# Altium schematic sheet StartupMCU.SchDoc
size 431 x 279 mm; Organization: ORGANIZATION; Address1: ADDRESS 1; Address2: ADDRESS 2; Address3: ADDRESS 3; Address4: ADDRESS 4; Revision: -; SheetNumber: 5; SheetTotal: 5; ENG_APP_DATE: --/--/--; DSN_APP_DATE: --/--/--; CHK_APP_DATE: --/--/--
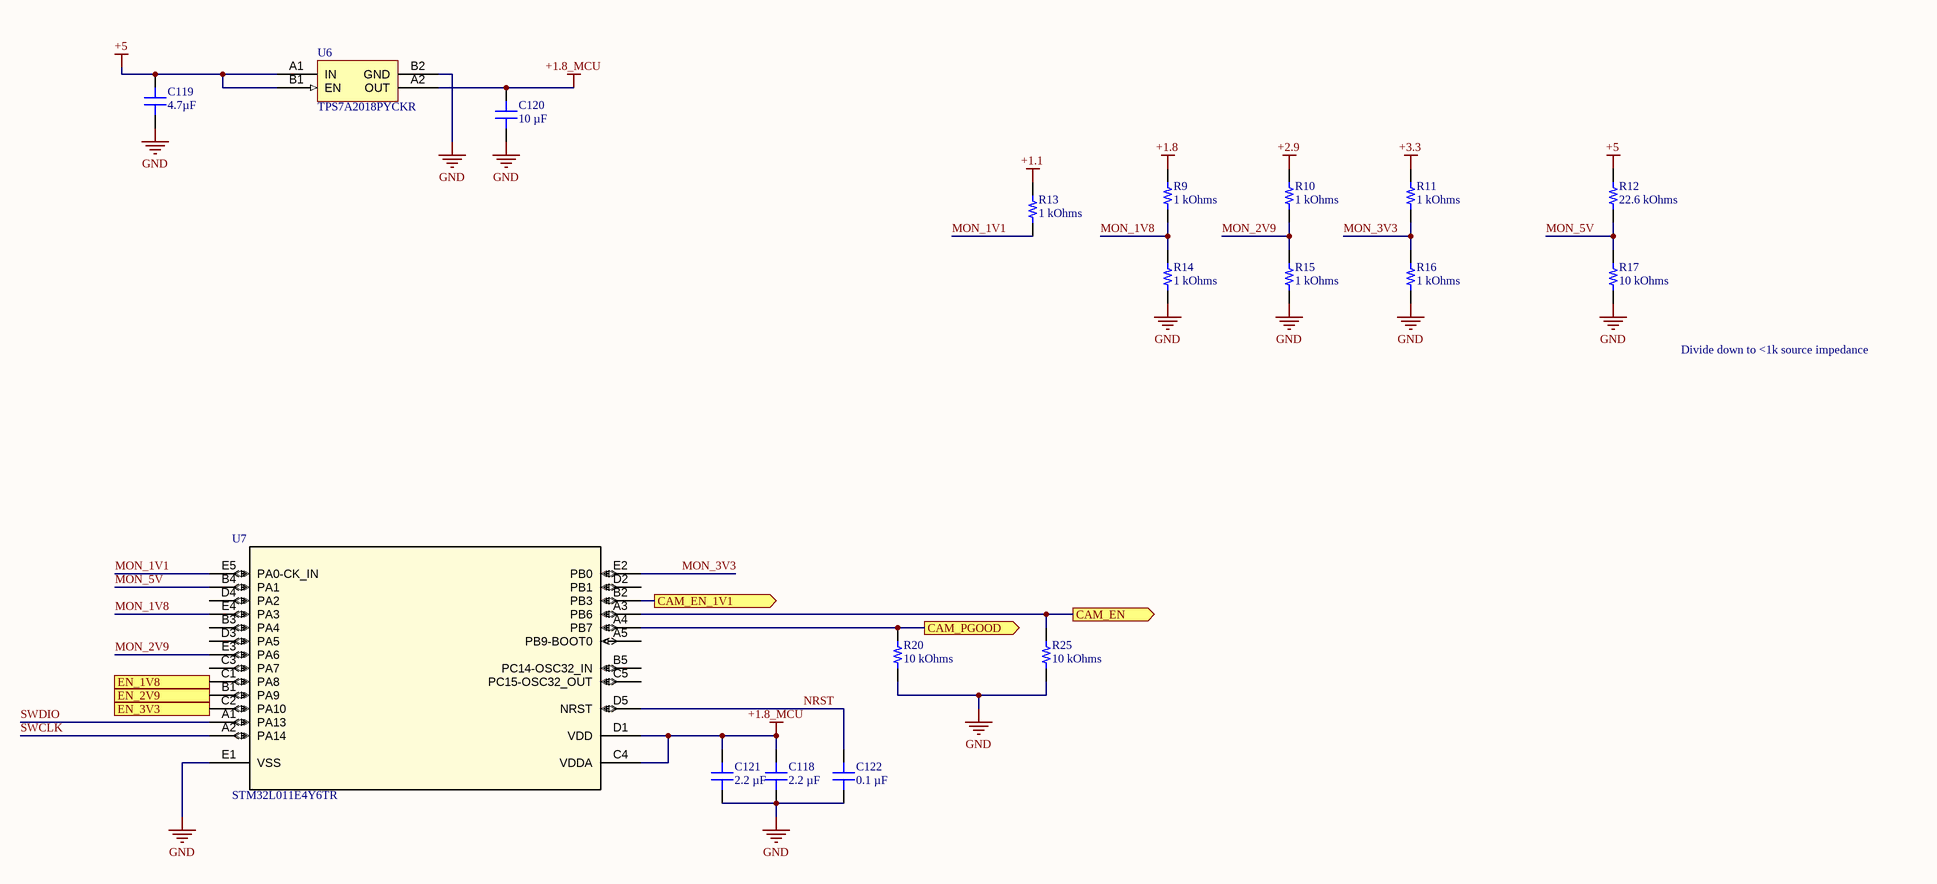
[diagram p0: StartupMCU.SchDoc]

## Parts
C118  2.2 µF  [FP-GRM033-0_09-MFG]
C119  4.7µF  [FP-GRM155-0_15-MFG]
C120  10 µF  [FP-GRM155-0_15-MFG]
C121  2.2 µF  [FP-GRM033-0_09-MFG]
C122  0.1 µF  [FP-GRM033-0_09-MFG]
R9  1 kOhms  [RES 0201_0603]
R10  1 kOhms  [RES 0201_0603]
R11  1 kOhms  [RES 0201_0603]
R12  22.6 kOhms  [RES 0201_0603]
R13  1 kOhms  [RES 0201_0603]
R14  1 kOhms  [RES 0201_0603]
R15  1 kOhms  [RES 0201_0603]
R16  1 kOhms  [RES 0201_0603]
R17  10 kOhms  [RES 0201_0603]
R20  10 kOhms  [RES 0201_0603]
R25  10 kOhms  [RES 0201_0603]
U6  TPS7A2018PYCKR  [BGA4C35P2X2_62X62X35]
U7  STM32L011E4Y6TR  [BGA25C40P5X5_207X213X58]

## Ports
CAM_EN (out), CAM_EN_1V1 (out), CAM_PGOOD (out), EN_1V8 (out), EN_2V9 (out), EN_3V3 (out)

## Nets
+1.1: R13.2
+1.8: R9.2
+1.8_MCU: C118.2 C120.2 C121.2 U6.A2(OUT) U7.C4(VDDA) U7.D1(VDD)
+2.9: R10.2
+3.3: R11.2
+5: C119.2 R12.2 U6.A1(IN) U6.B1(EN)
GND: C118.1 C119.1 C120.1 C121.1 C122.1 R14.1 R15.1 R16.1 R17.1 R20.1 R25.1 U6.B2(GND) U7.E1(VSS)
CAM_EN: R25.2 U7.A3(PB6) ; port CAM_EN
CAM_EN_1V1: U7.B2(PB3) ; port CAM_EN_1V1
CAM_PGOOD: R20.2 U7.A4(PB7) ; port CAM_PGOOD
EN_1V8: U7.C1(PA8) ; port EN_1V8
EN_2V9: U7.B1(PA9) ; port EN_2V9
EN_3V3: U7.C2(PA10) ; port EN_3V3
MON_1V1: R13.1 U7.E5(PA0-CK_IN)
MON_1V8: R9.1 R14.2 U7.E4(PA3)
MON_2V9: R10.1 R15.2 U7.E3(PA6)
MON_3V3: R11.1 R16.2 U7.E2(PB0)
MON_5V: R12.1 R17.2 U7.B4(PA1)
NRST: C122.2 U7.D5(NRST)
SWCLK: U7.A2(PA14)
SWDIO: U7.A1(PA13)

Not connected (* = marked no-connect by the designer): U7 A5(PB9-BOOT0) B3(PA4) B5(PC14-OSC32_IN) C3(PA7) C5(PC15-OSC32_OUT) D2(PB1) D3(PA5) D4(PA2)

## Notes on the sheet
- Divide down to <1k source impedance
- DWG. NO.
- REV.
- SHT.
- REVISION
- DESCRIPTION
- DATE
- APPROVED
- ENG:
- APPROVALS
- PROJECT
- DSN:
- CHK:
- REFERENCE DOCUMENTS
- PROJECT REVISION:
- TITLE
- SimulaVR
- DOCUMENT REVISION:
- DESIGN ITEM:
- BOM:
- FAB DWG:
- PCB DWG:
- ASSY DWG:
- SCALE:
- SIZE
- B
- CAGE CODE
- FILE NAME
- DWG NO.
- SHEET
- OF
- REV

## Library data of the parts
C118 C121 = GRM033R60J225ME01D: CAP CER 2.2UF 6.3V X5R 0201; manufacturer: Murata Electronics; Tolerance: ±20%; Part Number: GRM033R60J225ME01D; Value: 2.2 µF; Applications: General Purpose; Capacitance: 2.2 µF; componentlink1description: Datasheet; componentlink1url: https://search.murata.co.jp/Ceramy/image/img/A01X/G101/ENG/GRM033R60J225ME01-01A.pdf; componentlink2description: DigiKey Link; componentlink2url: https://www.digikey.com/en/products/detail/murata-electronics/GRM033R60J225ME01D/16033628; Device Package: 0201 (0603 Metric); lastupdated: 19.09.2022 12:54:17; Lifecycle Status: Active; Minimum Order: 1; Mounting Type: Surface Mount, MLCC; Operating Temperature: -55°C ~ 85°C; Package / Case: 0201 (0603 Metric); packaging: TapeAndReel; partid: 41005; Part Status: Active; price: 0.02; series: GRM; Size / Dimension: 0.024" L x 0.012" W (0.60mm x 0.30mm); Supplier 1: DigiKey; Supplier Part Number 1: 490-GRM033R60J225ME01DCT-ND; Temperature Coefficient: X5R; Thickness (Max): 0.015" (0.39mm); Voltage - Rated: 6.3V
C119 = GRM155R61A475MEAAD: CAP CER 4.7UF 10V X5R 0402; Manufacturer: Murata Electronics; Tolerance: ±20%; Part Number: GRM155R61A475MEAAD; Value: 4.7µF; Applications: General Purpose; Capacitance: 4.7µF; ComponentLink1Description: Datasheet; ComponentLink1URL: https://search.murata.co.jp/Ceramy/image/img/A01X/G101/ENG/GRM155R61A475MEAA-01.pdf; ComponentLink2Description: DigiKey Link; ComponentLink2URL: https://www.digikey.com/en/products/detail/murata-electronics/GRM155R61A475MEAAD/6234735; Device Package: 0402 (1005 Metric); LastUpdated: 2/8/2022 12:26:50 PM; Lifecycle Status: Active; Minimum Order: 1; Mounting Type: Surface Mount, MLCC; Operating Temperature: -55°C ~ 85°C; Package / Case: 0402 (1005 Metric); Packaging: TapeAndReel; PartId: 6746; Part Status: Active; Price: 0.03; Series: GRM; Size / Dimension: 0.039" L x 0.020" W (1.00mm x 0.50mm); Supplier 1: DigiKey; Supplier Part Number 1: 490-14306-1-ND; Temperature Coefficient: X5R; Thickness (Max): 0.026" (0.65mm); Voltage - Rated: 10V
C120 = GRM155R60J106ME15D: CAP CER 10UF 6.3V X5R 0402; manufacturer: Murata Electronics; Tolerance: ±20%; Part Number: GRM155R60J106ME15D; Value: 10 µF; Applications: General Purpose; Capacitance: 10 µF; componentlink1description: Datasheet; componentlink1url: https://www.murata.com/~/media/webrenewal/support/library/catalog/products/capacitor/mlcc/c02e.ashx?la=en-us; componentlink2description: DigiKey Link; componentlink2url: https://www.digikey.com/en/products/detail/murata-electronics/GRM155R60J106ME15D/5877401; Device Package: 0402 (1005 Metric); lastupdated: 19.09.2022 12:57:20; Lifecycle Status: Active; Minimum Order: 1; Mounting Type: Surface Mount, MLCC; Operating Temperature: -55°C ~ 85°C; Package / Case: 0402 (1005 Metric); packaging: TapeAndReel; partid: 6754; Part Status: Active; price: 0.02; series: GRM; Size / Dimension: 0.039" L x 0.020" W (1.00mm x 0.50mm); Supplier 1: DigiKey; Supplier Part Number 1: 490-13238-1-ND; Temperature Coefficient: X5R; Thickness (Max): 0.026" (0.65mm); Voltage - Rated: 6.3V
C122 = GRM033R61C104KE14D: CAP CER 0.1UF 16V X5R 0201; manufacturer: Murata Electronics; Tolerance: ±10%; Part Number: GRM033R61C104KE14D; Value: 0.1 µF; Applications: General Purpose; Capacitance: 0.1 µF; componentlink1description: Datasheet; componentlink1url: https://search.murata.co.jp/Ceramy/image/img/A01X/G101/ENG/GRM033R61C104KE14-01.pdf; componentlink2description: DigiKey Link; componentlink2url: https://www.digikey.com/en/products/detail/murata-electronics/GRM033R61C104KE14D/6234734; Device Package: 0201 (0603 Metric); lastupdated: 19.09.2022 12:54:28; Lifecycle Status: Active; Minimum Order: 1; Mounting Type: Surface Mount, MLCC; Operating Temperature: -55°C ~ 85°C; Package / Case: 0201 (0603 Metric); packaging: TapeAndReel; partid: 41462; Part Status: Active; price: 0.01; series: GRM; Size / Dimension: 0.024" L x 0.012" W (0.60mm x 0.30mm); Supplier 1: DigiKey; Supplier Part Number 1: 490-14305-1-ND; Temperature Coefficient: X5R; Thickness (Max): 0.013" (0.33mm); Voltage - Rated: 16V
R9-R11 R13-R16 = CRCW02011K00FKED: RES SMD 1K OHM 1% 1/20W 0201; Manufacturer: Vishay Dale; Power (Watts): 0.05W, 1/20W; Temperature Coefficient: ±100ppm/°C; Part Number: CRCW02011K00FKED; Value: 1 kOhms; ComponentLink1Description: Datasheet; ComponentLink1URL: http://www.vishay.com/docs/20052/crcw0201e3.pdf; ComponentLink2Description: DigiKey Link; ComponentLink2URL: https://www.digikey.com/en/products/detail/vishay-dale/CRCW02011K00FKED/1967979; Composition: Thick Film; Device Package: 0201 (0603 Metric); Height - Seated (Max): 0.010" (0.26mm); LastUpdated: 19.09.2022 13:09:18; Lifecycle Status: Active; Minimum Order: 1; Number of Terminations: 2; Operating Temperature: -55°C ~ 155°C; Package / Case: 0201 (0603 Metric); Packaging: TapeAndReel; PartId: 34; Part Status: Active; Price: 0.03; Resistance: 1 kOhms; Series: CRCW; Size / Dimension: 0.024" L x 0.012" W (0.60mm x 0.30mm); Supplier 1: DigiKey; Supplier Part Number 1: 541-1.00KAABCT-ND; Supplier Device Package: 0201; Tolerance: ±1%
R12 = RC0201FR-0722K6L: RES 22.6K OHM 1% 1/20W 0201; Manufacturer: Yageo; Power (Watts): 0.05W, 1/20W; Temperature Coefficient: ±200ppm/°C; Part Number: RC0201FR-0722K6L; Value: 22.6 kOhms; ComponentLink1Description: Datasheet; ComponentLink1URL: https://www.yageo.com/upload/media/product/productsearch/datasheet/rchip/PYu-RC_Group_51_RoHS_L_10.pdf; ComponentLink2Description: DigiKey Link; ComponentLink2URL: https://www.digikey.com/en/products/detail/yageo/RC0201FR-0722K6L/5280375; Composition: Thick Film; Device Package: 0201 (0603 Metric); Features: Moisture Resistant; Height - Seated (Max): 0.010" (0.26mm); LastUpdated: 19.09.2022 13:09:16; Lifecycle Status: Active; Minimum Order: 1; Number of Terminations: 2; Operating Temperature: -55°C ~ 125°C; Package / Case: 0201 (0603 Metric); Packaging: CutTape; PartId: 401; Part Status: Active; Price: 0.01; Resistance: 22.6 kOhms; Series: RC_L; Size / Dimension: 0.024" L x 0.012" W (0.60mm x 0.30mm); Supplier 1: DigiKey; Supplier Part Number 1: YAG2515CT-ND; Supplier Device Package: 0201; Tolerance: ±1%
R17 R20 R25 = RMCF0201JG10K0: RES 10K OHM 5% 1/20W 0201; Manufacturer: Stackpole Electronics Inc; Power (Watts): 0.05W, 1/20W; Temperature Coefficient: ±200ppm/°C; Part Number: RMCF0201JG10K0; Value: 10 kOhms; ComponentLink1Description: Datasheet; ComponentLink1URL: https://www.seielect.com/catalog/sei-rmcf_rmcp.pdf; ComponentLink2Description: DigiKey Link; ComponentLink2URL: https://www.digikey.com/en/products/detail/stackpole-electronics-inc/RMCF0201JG10K0/6053790; Composition: Thick Film; Device Package: 0201 (0603 Metric); Height - Seated (Max): 0.010" (0.26mm); LastUpdated: 19.09.2022 13:09:10; Lifecycle Status: Active; Minimum Order: 1; Number of Terminations: 2; Operating Temperature: -55°C ~ 155°C; Package / Case: 0201 (0603 Metric); Packaging: CutTape; PartId: 1335; Part Status: Active; Price: 0.01; Ratings: AEC-Q200; Resistance: 10 kOhms; Series: RMCF; Size / Dimension: 0.024" L x 0.012" W (0.60mm x 0.30mm); Supplier 1: DigiKey; Supplier Part Number 1: RMCF0201JG10K0CT-ND; Supplier Device Package: 0201; Tolerance: ±5%
U6 = CMP-019-00055-1
U7 = CMP-017-000000-2: No Description Available; Mfr_Name: STMicroelectronics; RefDes: RefDes; Design Item ID: STM32L011E4Y6TR; Copyright: Copyright (C) 2022 Ultra Librarian. All rights reserved.; Type: DEV; Manufacturer_Part_Number: STM32L011E4Y6TR; Source: STM32L011E4Y6TR.SchLib